# EAGLE design mosfet (EAGLE 7.6.0)
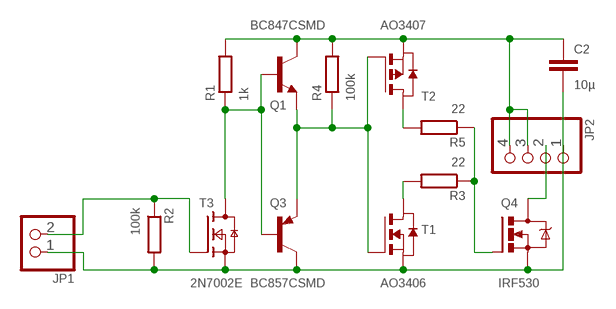
[diagram p0: schematic, sheet 1]

## Parts
C2  10µ  C-EUC0805K  [C0805K]
JP1  PINHD-1X2  [1X02]
JP2  PINHD-1X4  [1X04]
Q1  BC847CSMD  [SOT23]
Q3  BC857CSMD  [SOT23-BEC]
Q4  IRF530  [TO220BV]
R1  1k  R-EU_R0805  [R0805]
R2  100k  R-EU_R0805  [R0805]
R3  22  R-EU_R0805  [R0805]
R4  100k  R-EU_R0805  [R0805]
R5  22  R-EU_R0805  [R0805]
T1  AO3406  NMOSSOT23  [SOT-23]
T2  AO3407  PMOSSOT23  [SOT-23]
T3  2N7002E  [SOT23]

## Nets
N$1: Q4.G R3.1 R5.1
N$2: R5.2 T2.1(D)
N$3: C2.2 JP1.1 JP2.1 Q3.C Q4.S R2.2 T1.2(S) T3.2(S)
N$5: JP1.2 R2.1 T3.1(G)
N$6: Q1.1(B) Q3.B R1.1 T3.3(D)
N$7: Q1.2(E) Q3.E R4.1 T1.3(G) T2.3(G)
N$8: C2.1 JP2.3 JP2.4 Q1.3(C) R1.2 R4.2 T2.2(S)
N$9: R3.2 T1.1(D)
N$10: JP2.2 Q4.D

## Library data of the parts
C2 = rcl:C-EU: CAPACITOR, European symbol
JP1 = pinhead:PINHD-1X2: PIN HEADER
JP2 = pinhead:PINHD-1X4: PIN HEADER
Q1 = transistor-npn:BC847*: NPN Transistor
Q3 = transistor-pnp:BC857*: PNP Transistror
Q4 = transistor-power:IRF530: HEXFET Power MOSFET
R1-R5 = rcl:R-EU_: RESISTOR, European symbol
T1 = zetex:NMOSSOT23: MOS FET; OC_FARNELL: unknown; OC_NEWARK: unknown
T2 = zetex:PMOSSOT23: MOS FET; OC_FARNELL: unknown; OC_NEWARK: unknown
T3 = nxp_60:2N7002: N-channel TrenchMOS FET N-channel enhancement mode Field-Effect Transistor (FET) in a plastic package using TrenchMOS technology. AAL Eindhoven MK

## Board
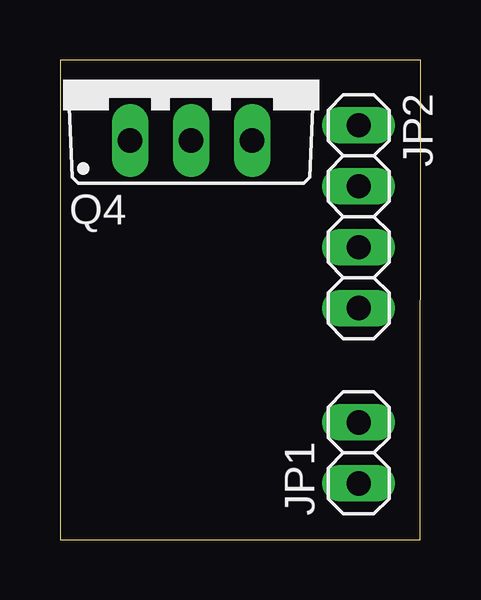
[diagram p1: board, top side]
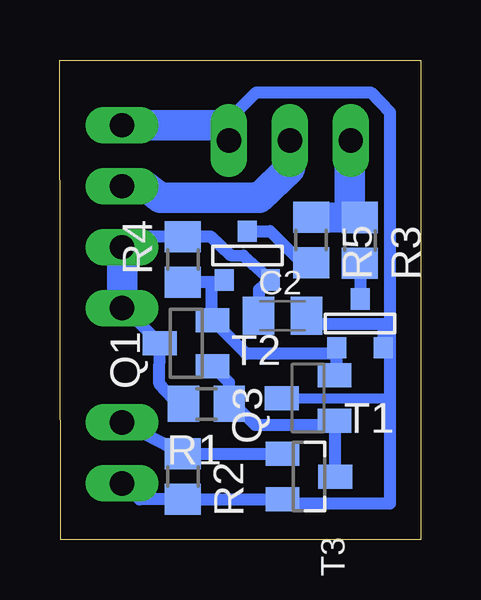
[diagram p2: board, bottom side, seen from below]

Size 15.04 x 19.99 mm. Coordinates in mm from the lower left corner, seen from the top.
Outline: 0,0 15.01,0 15.04,19.99 0,19.99 0,0
Copper layers (1*16): Top 0.035mm / dielectric 1.5mm / Bottom 0.035mm
Design rules "default": minimum track width 10mil, minimum drill 24mil, track to track 8mil, track to pad 8mil, pad to pad 8mil, via to via 8mil, smd to smd 8mil, copper to edge 40mil, drill to drill 8mil, minimum pad ring 10mil, minimum via ring 8mil, stop-mask expansion 4mil, vias tented up to drill 0mil, thermal gap 10mil

### Footprints (pad centres in the part's own frame; a part is rotated, then mirrored left to right if it is on the bottom)
C0805K = smd 1.3 x 1.6: 1 -1,0; 2 1,0
1X02 = drill 1.016 long: 1 -1.27,0; 2 1.27,0
1X04 = drill 1.016 long: 1 -3.81,0; 2 -1.27,0; 3 1.27,0; 4 3.81,0
SOT23 = smd 1 x 1.4: 1 -0.95,-1.1; 2 0.95,-1.1; 3 0,1.1
SOT23-BEC = smd 1 x 1.4: B -0.95,-1.1; C 0,1.1; E 0.95,-1.1
TO220BV = drill 1.016 long: D 0,-2.54; G -2.54,-2.54; S 2.54,-2.54
R0805 = smd 1.3 x 1.5: 1 -0.95,0; 2 0.95,0
SOT-23 = smd 0.787 x 0.889: 1 0.025,-1.016; 2 -0.94,1.016; 3 0.991,1.016

### Placement (x,y rotation side)
C2  5.76,9.33 0 bottom
JP1  12.45,3.62 90 top
JP2  12.45,13.46 270 top
Q1  9.78,8.19 90 bottom
Q3  4.7,5.91 90 bottom
Q4  5.46,19.18 0 top
R1  8.94,5.67 180 bottom
R2  9.92,2.64 270 bottom
R3  2.54,12.48 270 bottom
R4  9.92,11.68 90 bottom
R5  4.57,12.49 270 bottom
T1  2.51,9.02 180 bottom
T2  7.21,11.84 180 bottom
T3  4.67,2.64 270 bottom

### Tracks (layer width: path | path; a pad name or v marks a point on that pad's centre or on a via)
N$1
  Bottom 1.27: Q4.G 2.97,16.59 2.97,13.48 2.92,13.43 R3.1 2.9,13.41 R5.1
N$2
  Bottom 0.5: T2.1 6.29,12.86 4.97,11.54 R5.2
N$3
  Bottom 0.254: 7.91,17.59 Q4.S | 4.39,8.97 C2.2 | Q3.C 5.76,5.84 5.64,5.9
  Bottom 0.406: 5.64,5.9 1.29,5.9
  Bottom 0.5: 1.29,8.97 1.29,17.81 2.09,18.64 6.86,18.64 7.91,17.59 | 1.29,8.97 4.39,8.97 | JP1.1 11.72,1.69 R2.2 T3.2 5.44,1.52 1.29,1.52 1.29,5.9 1.29,8.91 | 1.29,8.97 1.29,8.91 | 1.29,8.91 1.57,8.64 T1.2
  Bottom 1.27: Q4.S 8,16.95 8.32,17.27 JP2.1
N$5
  Bottom 0.5: JP1.2 R2.1 T3.1
N$6
  Bottom 0.254: 7.82,5.68 7.73,5.75
  Bottom 0.5: T3.3 3.57,4.92 Q3.B 3.78,4.78 6.91,4.78 7.79,5.67 R1.1 | R1.1 7.99,6.55 Q1.1 | 7.82,5.68 7.97,5.68 R1.1
N$7
  Bottom 0.5: T2.3 8.23,10.8 8.71,10.73 | 8.71,10.73 R4.1 | 8.71,10.73 8.71,9.18 Q1.2 7.29,7.75 3.75,7.75 T1.3 3.5,6.96 Q3.E
N$8
  Bottom 0.254: R1.2 9.87,5.68 10.02,5.56
  Bottom 0.5: 10.02,5.56 10.89,6.5 Q1.3 12.34,9.65 JP2.4 | C2.1 6.74,10.43 T2.2 7.39,11.84 7.95,11.86 8.76,12.63 R4.2 11.94,12.63 JP2.3
  Bottom 1.27: JP2.3 JP2.4
N$9
  Bottom 0.5: R3.2 2.53,11.24 T1.1
N$10
  Bottom 1.27: Q4.D 5.46,15.46 6.73,14.26 10.86,14.26 11.49,14.73 JP2.2